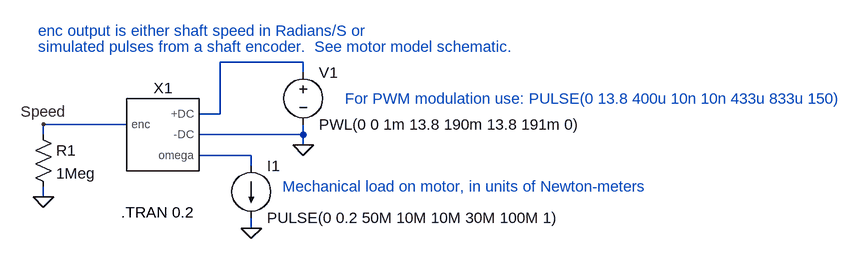
[diagram p0: schematic dc_motor_testbed.asc]
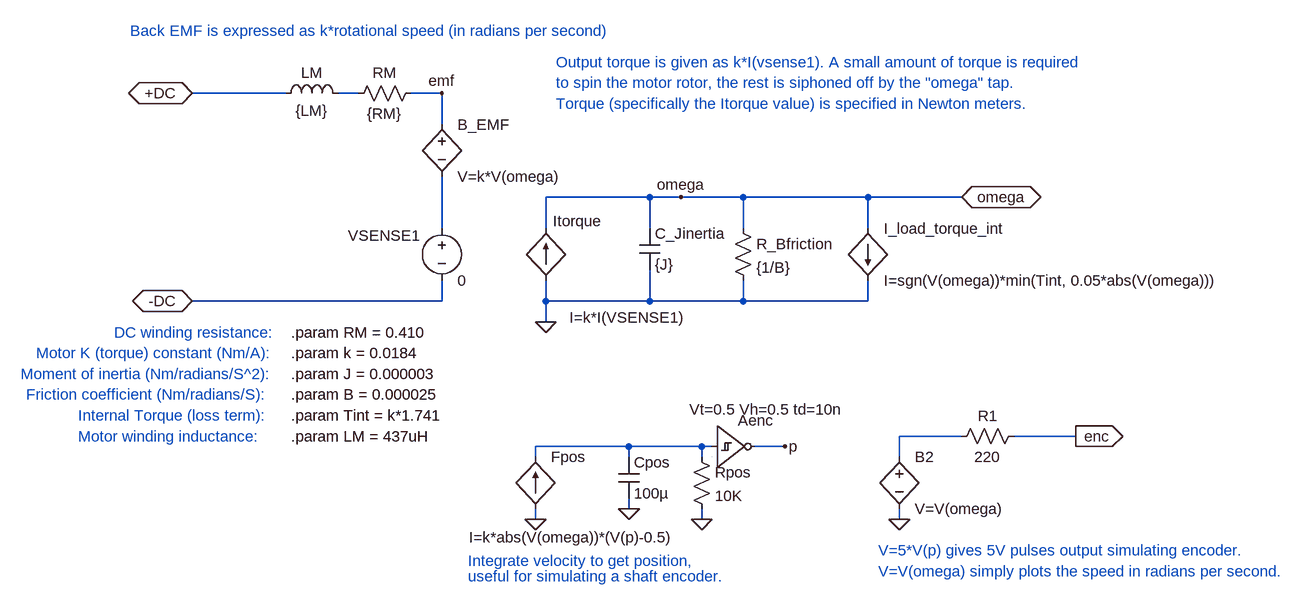
[diagram p1: sub-circuit dc_motor.asc]
dc_motor_testbed.asc, the LTspice schematic file:
Version 4
SHEET 1 1360 680
WIRE 400 64 272 64
WIRE 400 80 400 64
WIRE 272 144 272 64
WIRE 272 144 240 144
WIRE 128 160 0 160
WIRE 0 176 0 160
WIRE 400 176 400 160
WIRE 400 176 240 176
WIRE 400 192 400 176
WIRE 320 208 240 208
WIRE 320 224 320 208
WIRE 0 272 0 256
WIRE 320 320 320 304
FLAG 400 192 0
FLAG 320 320 0
FLAG 0 272 0
FLAG 0 160 Speed
SYMBOL dc_motor 176 176 R0
SYMATTR InstName X1
SYMBOL voltage 400 64 R0
WINDOW 123 0 0 Left 2
WINDOW 39 0 0 Left 2
SYMATTR InstName V1
SYMATTR Value PWL(0 0 1m 13.8 190m 13.8 191m 0)
SYMBOL current 320 224 R0
WINDOW 123 0 0 Left 2
WINDOW 39 0 0 Left 2
SYMATTR InstName I1
SYMATTR Value PULSE(0 0.2 50M 10M 10M 30M 100M 1)
SYMBOL res -16 160 R0
SYMATTR InstName R1
SYMATTR Value 1Meg
TEXT 120 296 Left 2 !.TRAN 0.2
TEXT 464 120 Left 2 ;For PWM modulation use: PULSE(0 13.8 400u 10n 10n 433u 833u 150)
TEXT 368 256 Left 2 ;Mechanical load on motor, in units of Newton-meters
TEXT -8 16 Left 2 ;enc output is either shaft speed in Radians/S or
TEXT -8 40 Left 2 ;simulated pulses from a shaft encoder.  See motor model schematic.

dc_motor.asc, the sub-circuit schematic file:
Version 4
SHEET 1 1980 744
WIRE 32 -16 -112 -16
WIRE 144 -16 112 -16
WIRE 272 -16 224 -16
WIRE 272 32 272 -16
WIRE 592 144 432 144
WIRE 640 144 592 144
WIRE 736 144 640 144
WIRE 928 144 736 144
WIRE 1072 144 928 144
WIRE 272 192 272 112
WIRE 432 192 432 144
WIRE 592 192 592 144
WIRE 736 192 736 144
WIRE 928 192 928 144
WIRE 272 304 272 272
WIRE 272 304 -112 304
WIRE 432 304 432 272
WIRE 592 304 592 256
WIRE 592 304 432 304
WIRE 736 304 736 272
WIRE 736 304 592 304
WIRE 928 304 928 272
WIRE 928 304 736 304
WIRE 432 336 432 304
WIRE 1072 512 976 512
WIRE 1248 512 1152 512
WIRE 560 528 416 528
WIRE 672 528 560 528
WIRE 688 528 672 528
WIRE 800 528 752 528
WIRE 416 544 416 528
WIRE 560 544 560 528
WIRE 672 544 672 528
WIRE 976 544 976 512
WIRE 560 624 560 608
WIRE 416 640 416 624
WIRE 672 640 672 624
WIRE 976 640 976 624
FLAG -112 -16 +DC
IOPIN -112 -16 BiDir
FLAG -112 304 -DC
IOPIN -112 304 BiDir
FLAG 272 -16 emf
FLAG 432 336 0
FLAG 1072 144 omega
IOPIN 1072 144 BiDir
FLAG 640 144 omega
FLAG 416 640 0
FLAG 560 624 0
FLAG 800 528 p
FLAG 976 640 0
FLAG 1248 512 enc
IOPIN 1248 512 Out
FLAG 672 640 0
SYMBOL ind 16 0 R270
WINDOW 0 32 56 VTop 2
WINDOW 3 5 56 VBottom 2
SYMATTR InstName LM
SYMATTR Value {LM}
SYMBOL res 240 -32 R90
WINDOW 0 0 56 VBottom 2
WINDOW 3 32 56 VTop 2
SYMATTR InstName RM
SYMATTR Value {RM}
SYMBOL cap 576 192 R0
SYMATTR InstName C_Jinertia
SYMATTR Value {J}
SYMBOL res 720 176 R0
SYMATTR InstName R_Bfriction
SYMATTR Value {1/B}
SYMBOL voltage 272 176 R0
WINDOW 123 0 0 Left 2
WINDOW 39 0 0 Left 2
WINDOW 0 -144 27 Left 2
SYMATTR InstName VSENSE1
SYMATTR Value 0
SYMBOL bv 272 16 R0
SYMATTR InstName B_EMF
SYMATTR Value V=k*V(omega)
SYMBOL bi 928 192 R0
SYMATTR InstName I_load_torque_int
SYMATTR Value I=sgn(V(omega))*min(Tint, 0.05*abs(V(omega)))
SYMBOL bi 432 272 R180
WINDOW 0 -87 91 Left 2
WINDOW 3 -211 -57 Left 2
SYMATTR InstName Itorque
SYMATTR Value I=k*I(VSENSE1)
SYMBOL Digital\\schmtinv 688 464 R0
WINDOW 3 -35 7 Left 2
SYMATTR Value Vt=0.5 Vh=0.5 td=10n
SYMATTR InstName Aenc
SYMBOL cap 544 544 R0
SYMATTR InstName Cpos
SYMATTR Value 100µ
SYMBOL bi2 416 544 R0
WINDOW 3 -102 124 Left 2
SYMATTR Value I=k*abs(V(omega))*(V(p)-0.5)
SYMATTR InstName Fpos
SYMBOL bv 976 528 R0
SYMATTR InstName B2
SYMATTR Value V=V(omega)
SYMBOL res 1168 496 R90
WINDOW 0 0 56 VBottom 2
WINDOW 3 32 56 VTop 2
SYMATTR InstName R1
SYMATTR Value 220
SYMBOL res 656 528 R0
SYMATTR InstName Rpos
SYMATTR Value 10K
TEXT 40 352 Left 2 !.param RM = 0.410
TEXT 40 384 Left 2 !.param k = 0.0184
TEXT 40 416 Left 2 !.param J = 0.000003
TEXT 40 448 Left 2 !.param B = 0.000025
TEXT 40 480 Left 2 !.param Tint = k*1.741
TEXT 40 512 Left 2 !.param LM = 437uH
TEXT 448 -64 Left 2 ;Output torque is given as k*I(vsense1). A small amount of torque is required
TEXT 448 -32 Left 2 ;to spin the motor rotor, the rest is siphoned off by the "omega" tap.
TEXT 448 0 Left 2 ;Torque (specifically the Itorque value) is specified in Newton meters.
TEXT -208 -112 Left 2 ;Back EMF is expressed as k*rotational speed (in radians per second)
TEXT -232 352 Left 2 ;DC winding resistance:
TEXT -352 384 Left 2 ;Motor K (torque) constant (Nm/A):
TEXT -368 448 Left 2 ;Friction coefficient (Nm/radians/S):
TEXT -376 416 Left 2 ;Moment of inertia (Nm/radians/S^2):
TEXT -288 480 Left 2 ;Internal Torque (loss term):
TEXT -288 512 Left 2 ;Motor winding inductance:
TEXT 944 688 Left 2 ;V=5*V(p) gives 5V pulses output simulating encoder.
TEXT 944 720 Left 2 ;V=V(omega) simply plots the speed in radians per second.
TEXT 312 704 Left 2 ;Integrate velocity to get position,
TEXT 312 728 Left 2 ;useful for simulating a shaft encoder.

The netlist it stands for:
* dc_motor_testbed.asc
XX1 N001 0 N002 Speed dc_motor
V1 N001 0 PWL(0 0 1m 13.8 190m 13.8 191m 0)
I1 N002 0 PULSE(0 0.2 50M 10M 10M 30M 100M 1)
R1 Speed 0 1Meg

* block symbol definitions
.subckt dc_motor +DC -DC omega enc
LM +DC N001 {LM}
RM emf N001 {RM}
C_Jinertia omega 0 {J}
R_Bfriction omega 0 {1/B}
VSENSE1 N002 -DC 0
B_EMF emf N002 V=k*V(omega)
B§I_load_torque_int omega 0 I=sgn(V(omega))*min(Tint, 0.05*abs(V(omega)))
B§Itorque 0 omega I=k*I(VSENSE1)
Aenc N004 0 0 0 0 p 0 0 SCHMITT Vt=0.5 Vh=0.5 td=10n
Cpos N004 0 100µ
B§Fpos 0 N004 I=k*abs(V(omega))*(V(p)-0.5)
B2 N003 0 V=V(omega)
R1 enc N003 220
Rpos N004 0 10K
.param RM = 0.410
.param k = 0.0184
.param J = 0.000003
.param B = 0.000025
.param Tint = k*1.741
.param LM = 437uH
* Output torque is given as k*I(vsense1). A small amount of torque is required
* to spin the motor rotor, the rest is siphoned off by the "omega" tap.
* Torque (specifically the Itorque value) is specified in Newton meters.
* Back EMF is expressed as k*rotational speed (in radians per second)
* DC winding resistance:
* Motor K (torque) constant (Nm/A):
* Friction coefficient (Nm/radians/S):
* Moment of inertia (Nm/radians/S^2):
* Internal Torque (loss term):
* Motor winding inductance:
* V=5*V(p) gives 5V pulses output simulating encoder.
* V=V(omega) simply plots the speed in radians per second.
* Integrate velocity to get position,
* useful for simulating a shaft encoder.
.ends dc_motor

.TRAN 0.2
* For PWM modulation use: PULSE(0 13.8 400u 10n 10n 433u 833u 150)
* Mechanical load on motor, in units of Newton-meters
* enc output is either shaft speed in Radians/S or
* simulated pulses from a shaft encoder.  See motor model schematic.
.backanno
.end

* Results of the author's LTspice run, read from the files saved beside the schematic
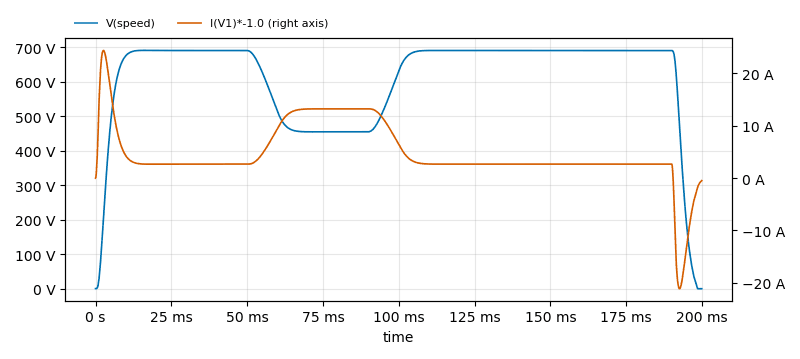
[diagram p2: Transient Analysis of dc_motor_testbed.asc, plotted from the saved traces]
* Transient Analysis, 1 run:
*   V(speed): min -539.7 mV, max 690.4 V, average 607.1 V, rms 625.1 V, last -165.9 mV
*   I(V1)*-1.0: min -21.14 A, max 24.41 A, average 4.717 A, rms 7.521 A, last -425.1 mA